# EAGLE schematic Strain_gauge_prototype_2 (EAGLE 7.2.0)
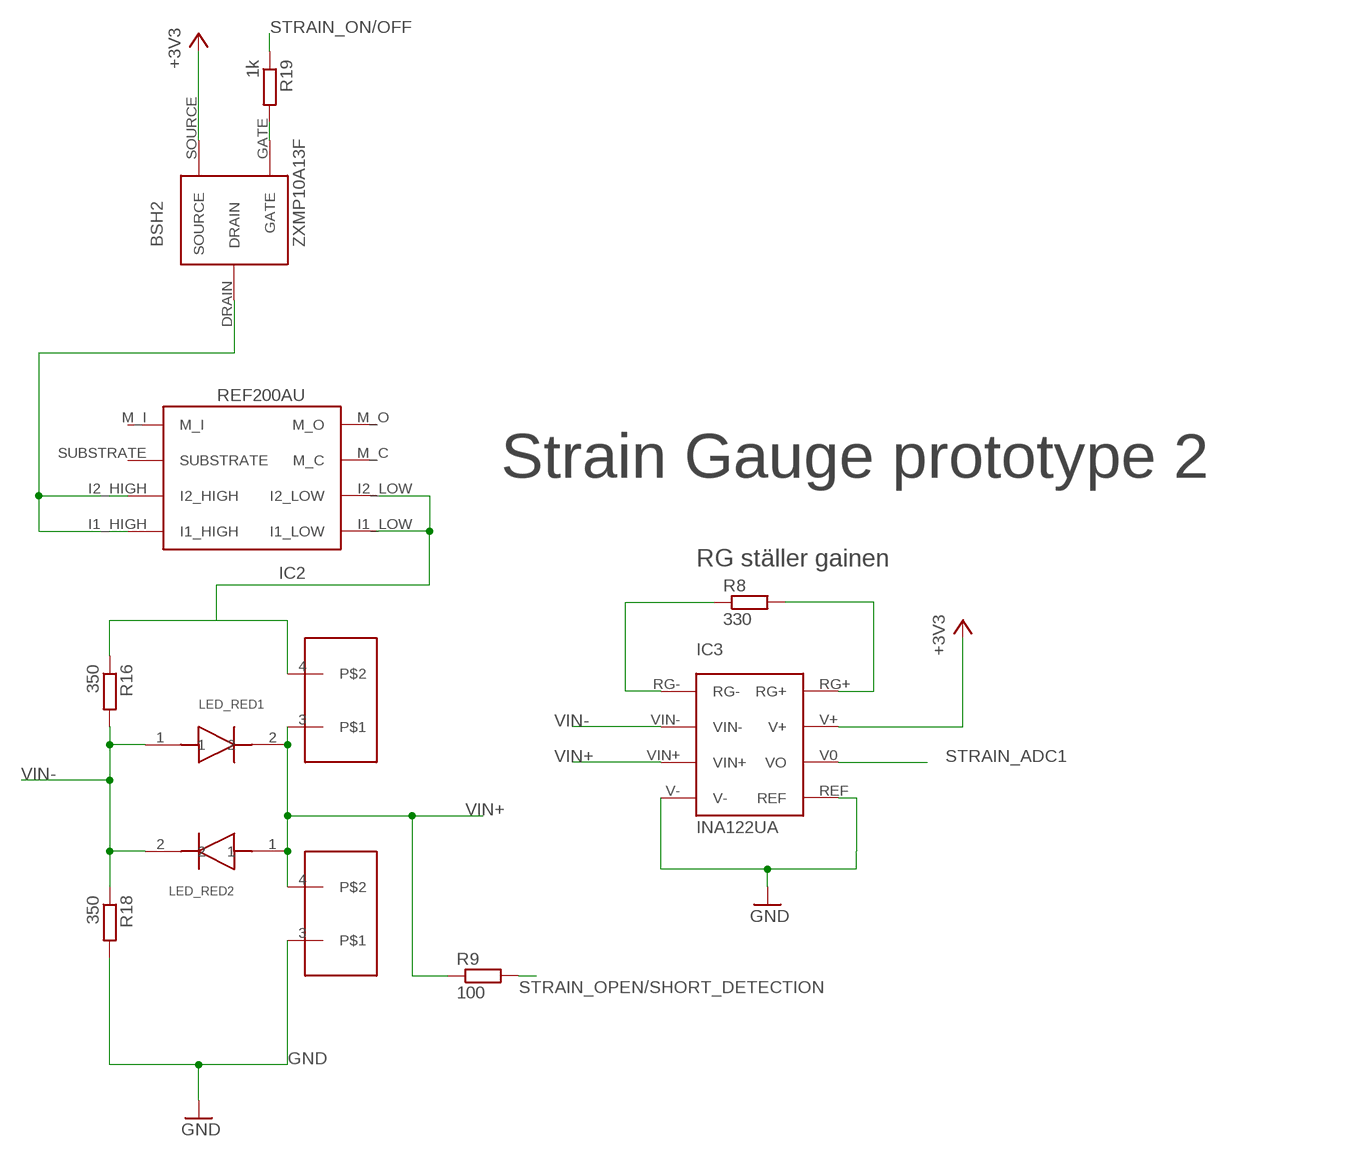
[diagram p0: schematic, sheet 1]

## Parts
BSH2  ZXMP10A13F  [P-CHANNEL]
IC2  REF200AU  [SOIC(8)]
IC3  INA122UA  [S0-8]
LED_RED1  SMD_LED  [SMD_LED_CUSTOM]
LED_RED2  SMD_LED  [SMD_LED_CUSTOM]
R8  330  R-EU_R0805  [R0805]
R9  100  R-EU_R0805  [R0805]
R16  350  R-EU_R0805  [R0805]
R18  350  R-EU_R0805  [R0805]
R19  1k  R-EU_R0805  [R0805]
SKRUVPLINT_2P1  SKRUVPLINT_2P  [SKRUVPLINT_2P]
SKRUVPLINT_2P3  SKRUVPLINT_2P  [SKRUVPLINT_2P]

## Nets
+3V3: BSH2.SOURCE IC3.V+
GND: IC3.V- R18.2 SKRUVPLINT_2P3.3
N$12: BSH2.DRAIN IC2.I1_HIGH IC2.I2_HIGH
N$13: IC3.RG- R8.1
N$14: IC3.RG+ R8.2
N$18: IC2.I1_LOW IC2.I2_LOW R16.1 SKRUVPLINT_2P1.4
N$19: BSH2.GATE R19.2
N$20: IC3.REF
STRAIN_ADC1: IC3.V0(VO)
STRAIN_ON/OFF: R19.1
STRAIN_OPEN/SHORT_DETECTION: R9.2
VIN+: IC3.VIN+ LED_RED1.2 LED_RED2.1 R9.1 SKRUVPLINT_2P1.3 SKRUVPLINT_2P3.4
VIN-: IC3.VIN- LED_RED1.1 LED_RED2.2 R16.2 R18.1
Unconnected: IC2.M_C IC2.M_I IC2.M_O IC2.SUBSTRATE

## Notes on the sheet
- Strain Gauge prototype 2
- RG ställer gainen

## Library data of the parts
BSH2 = ZXMP10A13F:ZXMP10A13F
IC2 = REF200:REF200AU
IC3 = AIN122:INA122UA
LED_RED1 LED_RED2 = greenled_smd:SMD_LED
R8 R9 R16 R18 R19 = rcl:R-EU_: RESISTOR, European symbol
SKRUVPLINT_2P1 SKRUVPLINT_2P3 = skruvplint2p_CTB0700:SKRUVPLINT_2P